# EAGLE schematic wx_station_sensors (EAGLE 4.16)
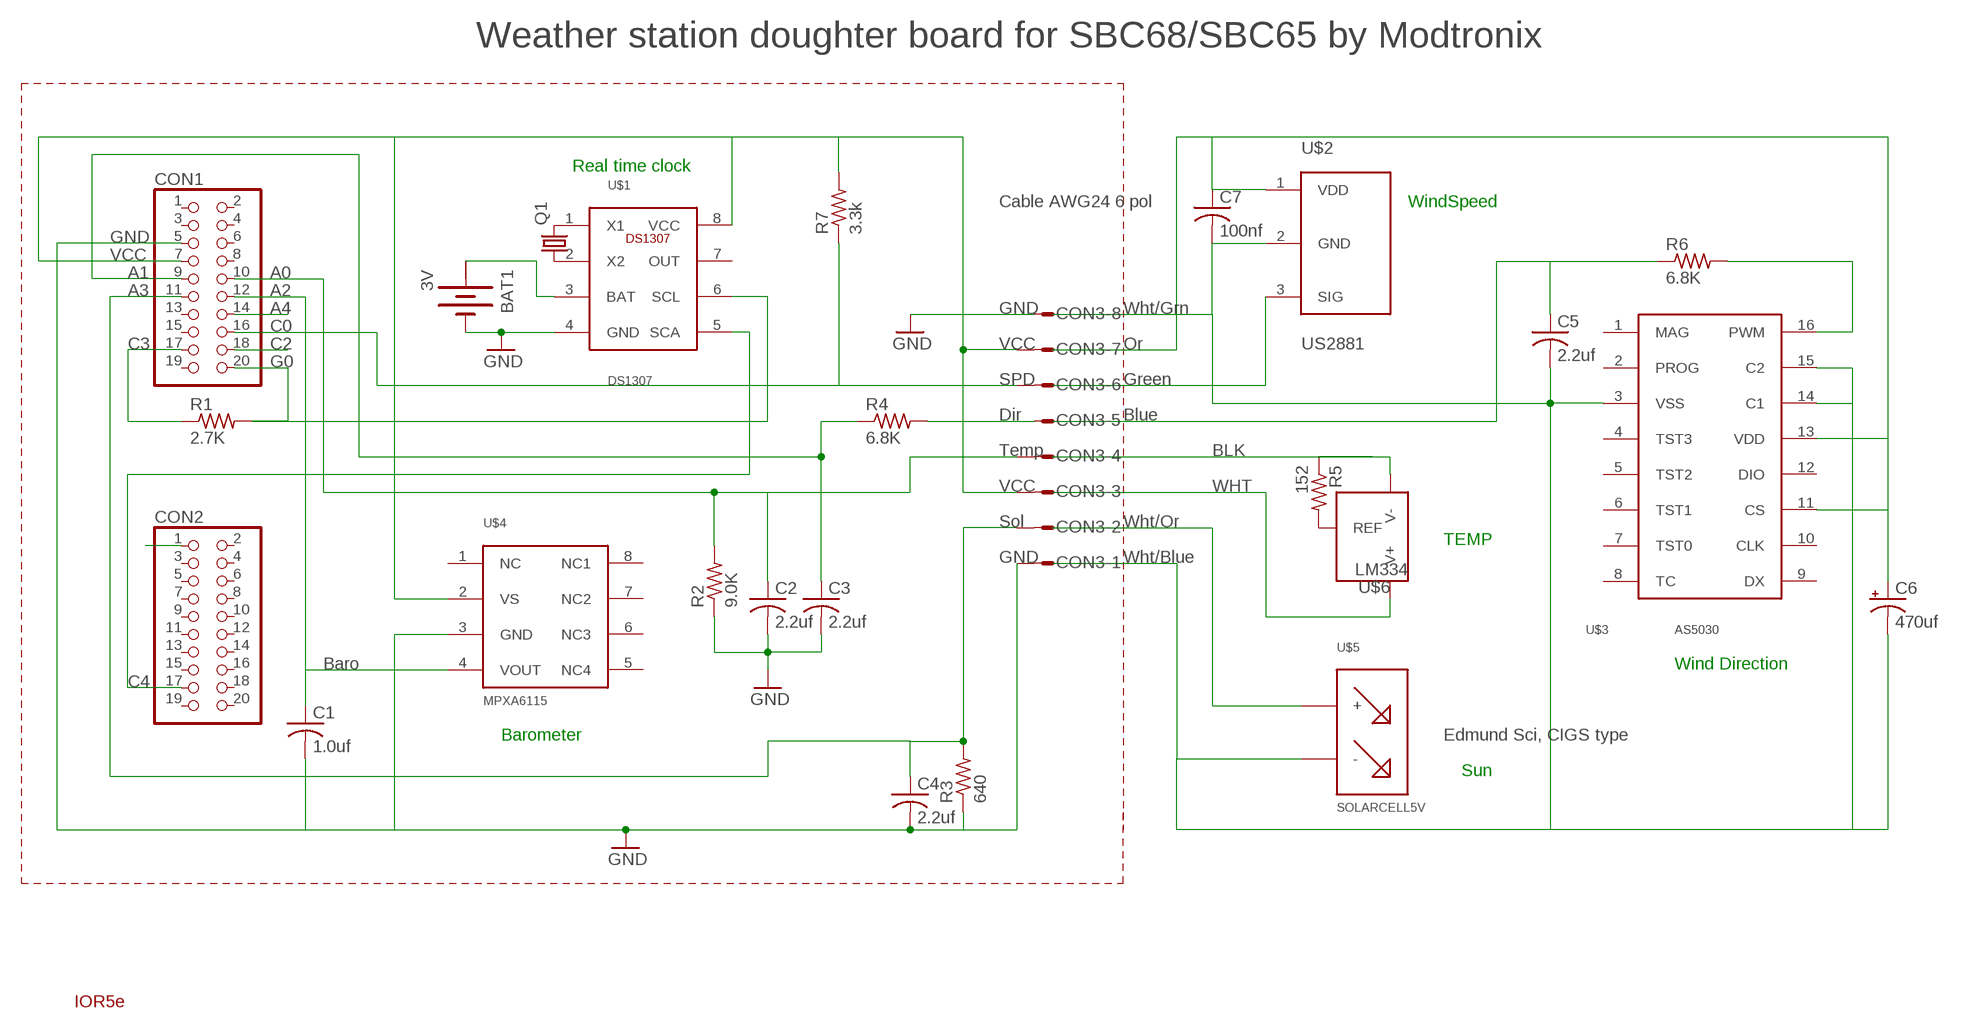
[diagram p0: schematic, sheet 1]

## Parts
BAT1  3V  BATTERY  [BATTERY]
C1  1.0uf  C-USC0805  [C0805]
C2  2.2uf  C-USC0805K  [C0805K]
C3  2.2uf  C-USC0805K  [C0805K]
C4  2.2uf  C-USC0805K  [C0805K]
C5  2.2uf  C-USC0805K  [C0805K]
C6  470uf  CPOL-USB45181B  [B45181B]
C7  100nf  C-USC0805K  [C0805K]
CON1  PINHD-2X10  [2X10]
CON2  PINHD-2X10  [2X10]
CON3  MT6-8  [MT6-8]
Q1  CRYSTALTC26H  [TC26H]
R1  2.7K  R-US_M0805  [M0805]
R2  9.0K  R-US_M0805  [M0805]
R3  640  R-US_M0805  [M0805]
R4  6.8K  R-US_M0805  [M0805]
R5  152  R-US_M0805  [M0805]
R6  6.8K  R-US_M0805  [M0805]
R7  3.3k  R-US_M0805  [M0805]
U$1  DS1307  [DIL08]
U$2  US2881  [TO92-]
U$3  AS5030  [TSSOP16]
U$4  MPXA6115  [SO08]
U$5  SOLARCELL5V  [SANYO-OSCON_D]
U$6  LM334  [TO92-]
U$7  IOR5E  [IOR5E]

## Nets
BAT: BAT1.+ U$1.3(BAT)
GND: BAT1.- C1.2 C2.2 C3.2 C4.2 CON1.5 CON3.1 R2.1 R3.1 U$1.4(GND) U$4.3(GND)
N$1: Q1.2 U$1.1(X1)
N$2: Q1.1 U$1.2(X2)
N$3: CON1.17 R1.1
N$4: CON1.20 R1.2 U$1.6(SCL)
N$5: CON2.17 U$1.5(SCA)
N$6: CON1.7 CON3.3 CON3.7 R7.2 U$1.8(VCC) U$4.2(VS)
N$7: C2.1 CON1.10 CON3.4 R2.2
N$8: C1.1 CON1.12 U$4.4(VOUT)
N$9: U$6.3(V+)
N$10: R4.2
N$11: C3.1 CON1.9 R4.1
N$12: R5.2 U$6.2(REF)
N$13: CON1.16 CON3.6 R7.1
N$14: R5.1 U$6.1(V-)
N$15: CON1.14
N$16: U$5.+
N$17: C6.+ C7.1 U$2.1(VDD) U$3.11(CS) U$3.13(VDD)
N$18: CON1.18
N$19: U$2.3(SIG)
N$21: C5.2 C6.- C7.2 U$2.2(GND) U$3.3(VSS) U$3.14(C1) U$3.15(C2) U$5.-
N$22: C5.1 R6.1
N$23: R6.2 U$3.16(PWM)
N$24: CON1.11 CON3.2 R3.2
PIN_1_2: CON2.1
Unconnected: C4.1 CON1.1 CON1.2 CON1.3 CON1.4 CON1.6 CON1.8 CON1.13 CON1.15 CON1.19 CON2.2 CON2.3 CON2.4 CON2.5 CON2.6 CON2.7 CON2.8 CON2.9 CON2.10 CON2.11 CON2.12 CON2.13 CON2.14 CON2.15 CON2.16 CON2.18 CON2.19 CON2.20 CON3.5 CON3.8 U$1.7(OUT) U$3.1(MAG) U$3.2(PROG) U$3.4(TST3) U$3.5(TST2) U$3.6(TST1) U$3.7(TST0) U$3.8(TC) U$3.9(DX) U$3.10(CLK) U$3.12(DIO) U$4.1(NC) U$4.5(NC4) U$4.6(NC3) U$4.7(NC2) U$4.8(NC1)

## Notes on the sheet
- Weather station doughter board for SBC68/SBC65 by Modtronix
- Real time clock
- Cable AWG24 6 pol | WindSpeed
- GND
- VCC
- A1 | A0
- A3 | A2
- A4 | GND | Wht/Grn
- C0
- C3 | C2 | VCC | Or
- G0
- SPD | Green
- Dir | Blue
- Temp | BLK
- VCC | WHT
- Sol | Wht/Or
- TEMP
- GND | Wht/Blue
- Baro | Wind Direction
- C4
- Barometer | Edmund Sci, CIGS type
- Sun

## Power pins joined to a net without a drawn wire
+: BAT1.+@1(+)

## Library data of the parts
BAT1 = special:BATTERY: BATTERY
C1-C5 C7 = rcl:C-US: CAPACITOR, American symbol
C6 = rcl:CPOL-US: POLARIZED CAPACITOR, American symbol
CON1 CON2 = pinhead:PINHD-2X10: PIN HEADER
CON3 = con-amp-mt:MT6-8: AMP MT6 CONNECTOR
Q1 = crystal:CRYSTAL: CRYSTAL
R1-R7 = rcl:R-US_: RESISTOR, American symbol
U$1 = maxim:DS1307
U$2 = Stofer:US2881
U$3 = Stofer:AS5030
U$4 = Stofer:MPXA6115
U$5 = Stofer:SOLARCELL5V
U$6 = Stofer:LM334
U$7 = PCB-Outlines:IOR5E